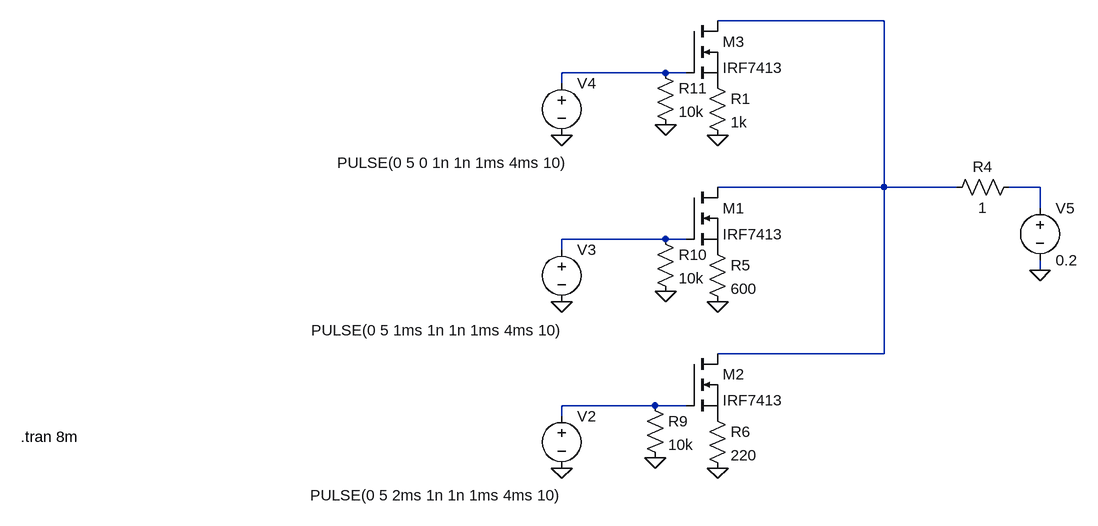
[diagram p0: schematic Draft1.asc]
Draft1.asc, the LTspice schematic file:
Version 4
SHEET 1 3224 728
WIRE 784 -480 528 -480
WIRE 448 -400 288 -400
WIRE 480 -400 448 -400
WIRE 288 -384 288 -400
WIRE 784 -224 784 -480
WIRE 784 -224 528 -224
WIRE 896 -224 784 -224
WIRE 1024 -224 976 -224
WIRE 1024 -192 1024 -224
WIRE 448 -144 288 -144
WIRE 480 -144 448 -144
WIRE 288 -128 288 -144
WIRE 1024 -96 1024 -112
WIRE 784 32 784 -224
WIRE 784 32 528 32
WIRE 432 112 288 112
WIRE 480 112 432 112
WIRE 288 128 288 112
FLAG 288 -304 0
FLAG 528 -48 0
FLAG 528 208 0
FLAG 528 -304 0
FLAG 288 -48 0
FLAG 288 208 0
FLAG 1024 -96 0
FLAG 448 -320 0
FLAG 448 -64 0
FLAG 432 192 0
SYMBOL voltage 288 -400 R0
WINDOW 3 -345 138 Left 2
WINDOW 123 0 0 Left 0
WINDOW 39 0 0 Left 0
SYMATTR Value PULSE(0 5 0 1n 1n 1ms 4ms 10)
SYMATTR InstName V4
SYMBOL voltage 288 -144 R0
WINDOW 3 -385 140 Left 2
WINDOW 123 0 0 Left 0
WINDOW 39 0 0 Left 0
SYMATTR Value PULSE(0 5 1ms 1n 1n 1ms 4ms 10)
SYMATTR InstName V3
SYMBOL voltage 288 112 R0
WINDOW 3 -387 138 Left 2
WINDOW 123 0 0 Left 0
WINDOW 39 0 0 Left 0
SYMATTR Value PULSE(0 5 2ms 1n 1n 1ms 4ms 10)
SYMATTR InstName V2
SYMBOL res 512 -400 R0
SYMATTR InstName R1
SYMATTR Value 1k
SYMBOL res 992 -240 R90
WINDOW 0 0 56 VBottom 2
WINDOW 3 32 56 VTop 2
SYMATTR InstName R4
SYMATTR Value 1
SYMBOL voltage 1024 -208 R0
WINDOW 123 0 0 Left 0
WINDOW 39 0 0 Left 0
SYMATTR InstName V5
SYMATTR Value 0.2
SYMBOL nmos 480 -480 R0
SYMATTR InstName M3
SYMATTR Value IRF7413
SYMBOL nmos 480 -224 R0
SYMATTR InstName M1
SYMATTR Value IRF7413
SYMBOL nmos 480 32 R0
SYMATTR InstName M2
SYMATTR Value IRF7413
SYMBOL res 416 96 R0
SYMATTR InstName R9
SYMATTR Value 10k
SYMBOL res 432 -160 R0
SYMATTR InstName R10
SYMATTR Value 10k
SYMBOL res 432 -416 R0
SYMATTR InstName R11
SYMATTR Value 10k
SYMBOL res 512 -144 R0
SYMATTR InstName R5
SYMATTR Value 600
SYMBOL res 512 112 R0
SYMATTR InstName R6
SYMATTR Value 220
TEXT -544 160 Left 2 !.tran 8m

The netlist it stands for:
* Draft1.asc
V4 N002 0 PULSE(0 5 0 1n 1n 1ms 4ms 10)
V3 N004 0 PULSE(0 5 1ms 1n 1n 1ms 4ms 10)
V2 N005 0 PULSE(0 5 2ms 1n 1n 1ms 4ms 10)
R1 P001 0 1k
R4 N003 N001 1
V5 N003 0 0.2
M3 N001 N002 P001 P001 IRF7413
M1 N001 N004 P002 P002 IRF7413
M2 N001 N005 P003 P003 IRF7413
R9 N005 0 10k
R10 N004 0 10k
R11 N002 0 10k
R5 P002 0 600
R6 P003 0 220
.model NMOS NMOS
.model PMOS PMOS
.lib standard.mos
.tran 8m
.backanno
.end

* Results of the author's LTspice run, read from the files saved beside the schematic
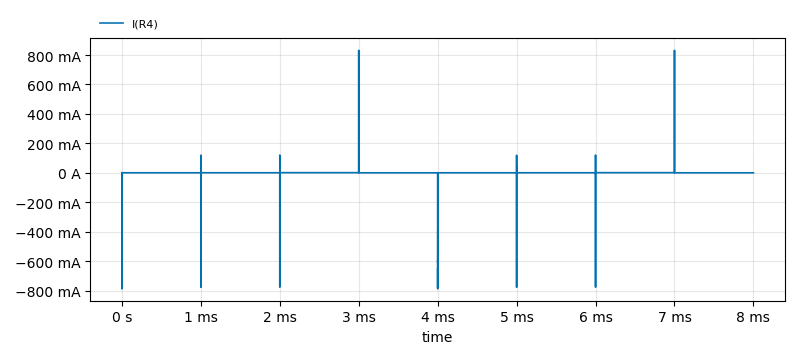
[diagram p1: Transient Analysis of Draft1.asc, plotted from the saved traces]
* Transient Analysis, 1 run:
*   I(R4): min -787.9 mA, max 831.6 mA, average 356.1 µA, rms 2.154 mA, last 0 A